# Altium schematic sheet Sheet1.SchDoc
size A3; SheetNumber: 1; SheetTotal: 1
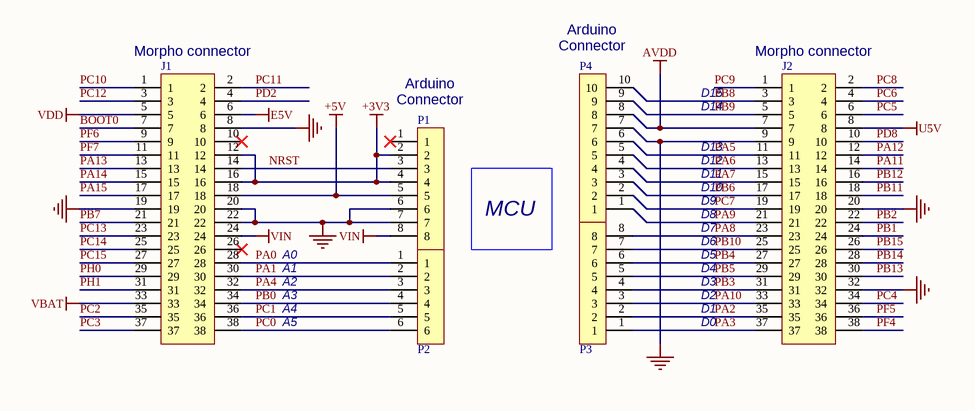
[diagram p0: Sheet1.SchDoc]

## Parts
J1  CES-119-02-T-D  [SAMTEC_CES-119-02-T-D]  (value not drawn)
J2  CES-119-02-T-D  [SAMTEC_CES-119-02-T-D]  (value not drawn)
P1  61300811121  [HDRV8W64P0X254_1X8_2032X254X854P]  (value not drawn)
P2  10129378-906001BLF  [10129378906001BLF]  (value not drawn)
P3  61300811121  [HDRV8W64P0X254_1X8_2032X254X854P]  (value not drawn)
P4  TSW-110-07-G-S  [HDRV10W64P0X254_1X10_2540X254X838P]  (value not drawn)

## Nets
+3V3: J1.12 J1.16 P1.2 P1.4
+5V: J1.18 P1.5
AVDD: J2.7 P4.8
E5V: J1.6
GND: J1.8 J1.19 J1.20 J1.22 J2.9 J2.20 J2.32 P1.6 P1.7 P4.7
U5V: J2.8
VBAT: J1.33
VDD: J1.5
VIN: J1.24 P1.8
BOOT0: J1.7
NRST: J1.14 P1.3
PA0: J1.28 P2.1
PA1: J1.30 P2.2
PA2: J2.35 P3.2
PA3: J2.37 P3.1
PA4: J1.32 P2.3
PA5: J2.11 P4.6
PA6: J2.13 P4.5
PA7: J2.15 P4.4
PA8: J2.23 P3.8
PA9: J2.21 P4.1
PA10: J2.33 P3.3
PA11: J2.14
PA12: J2.12
PA13: J1.13
PA14: J1.15
PA15: J1.17
PB0: J1.34 P2.4
PB1: J2.24
PB2: J2.22
PB3: J2.31 P3.4
PB4: J2.27 P3.6
PB5: J2.29 P3.5
PB6: J2.17 P4.3
PB7: J1.21
PB8: J2.3 P4.10
PB9: J2.5 P4.9
PB10: J2.25 P3.7
PB11: J2.18
PB12: J2.16
PB13: J2.30
PB14: J2.28
PB15: J2.26
PC0: J1.38 P2.6
PC1: J1.36 P2.5
PC2: J1.35
PC3: J1.37
PC4: J2.34
PC5: J2.6
PC6: J2.4
PC7: J2.19 P4.2
PC8: J2.2
PC9: J2.1
PC10: J1.1
PC11: J1.2
PC12: J1.3
PC13: J1.23
PC14: J1.25
PC15: J1.27
PD2: J1.4
PD8: J2.10
PF4: J2.38
PF5: J2.36
PF6: J1.9
PF7: J1.11
PH0: J1.29
PH1: J1.31

Not connected (* = marked no-connect by the designer): J1 10* 26*; P1 1*

## Notes on the sheet
- (near J1) Morpho connector
- (near P4) Arduino Connector
- D15
- (near J2) Morpho connector
- (near P1) Arduino Connector
- D14
- D13
- D12
- MCU
- D8
- D9
- D10
- D11
- D7
- A0
- A1
- A2
- A3
- D2
- D4
- D3
- D5
- D6
- A4
- A5
- D0
- D1

## Library data of the parts
J1 J2 = CES-119-02-T-D: Headers & Wire Housings .100" Closed Entry Low Profile Socket Strip, 2x19
P1 P3 = 61300811121: Headers & Wire Housings WR-PHD 2.54mm Hdr 8P Single Str Gold; Manufacturer_Name: Wurth Elektronik; Datasheet Link: http://katalog.we-online.de/em/datasheet/6130xx11121.pdf; Height: 8.54mm; Manufacturer_Part_Number: 61300811121; Mouser Part Number: 710-61300811121; Mouser Price/Stock: https://www.mouser.co.uk/ProductDetail/Wurth-Elektronik/61300811121?qs=PhR8RmCirEZRdx%252BVlEmRRA%3D%3D
P2 = 10129378-906001BLF: Headers & Wire Housings ECONOSTIK HEADER SR VT TH 1X6; Manufacturer_Name: Amphenol Communications Solutions; Datasheet Link: https://cdn.amphenol-cs.com/media/wysiwyg/files/documentation/datasheet/boardwiretoboard/bwb_econostik_254headers.pdf; Height: 8.58mm; Manufacturer_Part_Number: 10129378-906001BLF
P4 = TSW-110-07-G-S: Headers & Wire Housings Classic PCB Header Strips, 0.100" pitch; Manufacturer_Name: SAMTEC; Datasheet Link: https://suddendocs.samtec.com/catalog_english/tsw_th.pdf; Height: 8.38mm; Manufacturer_Part_Number: TSW-110-07-G-S; Mouser Part Number: 200-TSW11007GS; Mouser Price/Stock: https://www.mouser.co.uk/ProductDetail/Samtec/TSW-110-07-G-S?qs=FESYatJ8odKyHT0KAD0CRw%3D%3D; Arrow Part Number: TSW-110-07-G-S; Arrow Price/Stock: https://www.arrow.com/en/products/tsw-110-07-g-s/samtec?region=nac